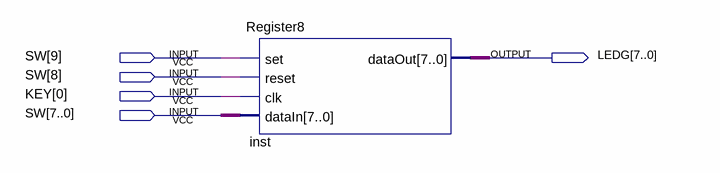
[diagram p0: schematic sheet]
// Quartus schematic Register_Demo.bdf as structural Verilog: 1 symbols, 5 pins
module Register_Demo (
  input  [9:0] SW,
  input  [0:0] KEY,
  output [7:0] LEDG
);

  Register8 inst (.set(SW[9]), .reset(SW[8]), .clk(KEY[0]), .dataIn(SW[7:0]), .dataOut(LEDG));
endmodule
